# Altium project MAIN.PrjPcb (part 1 of 2)
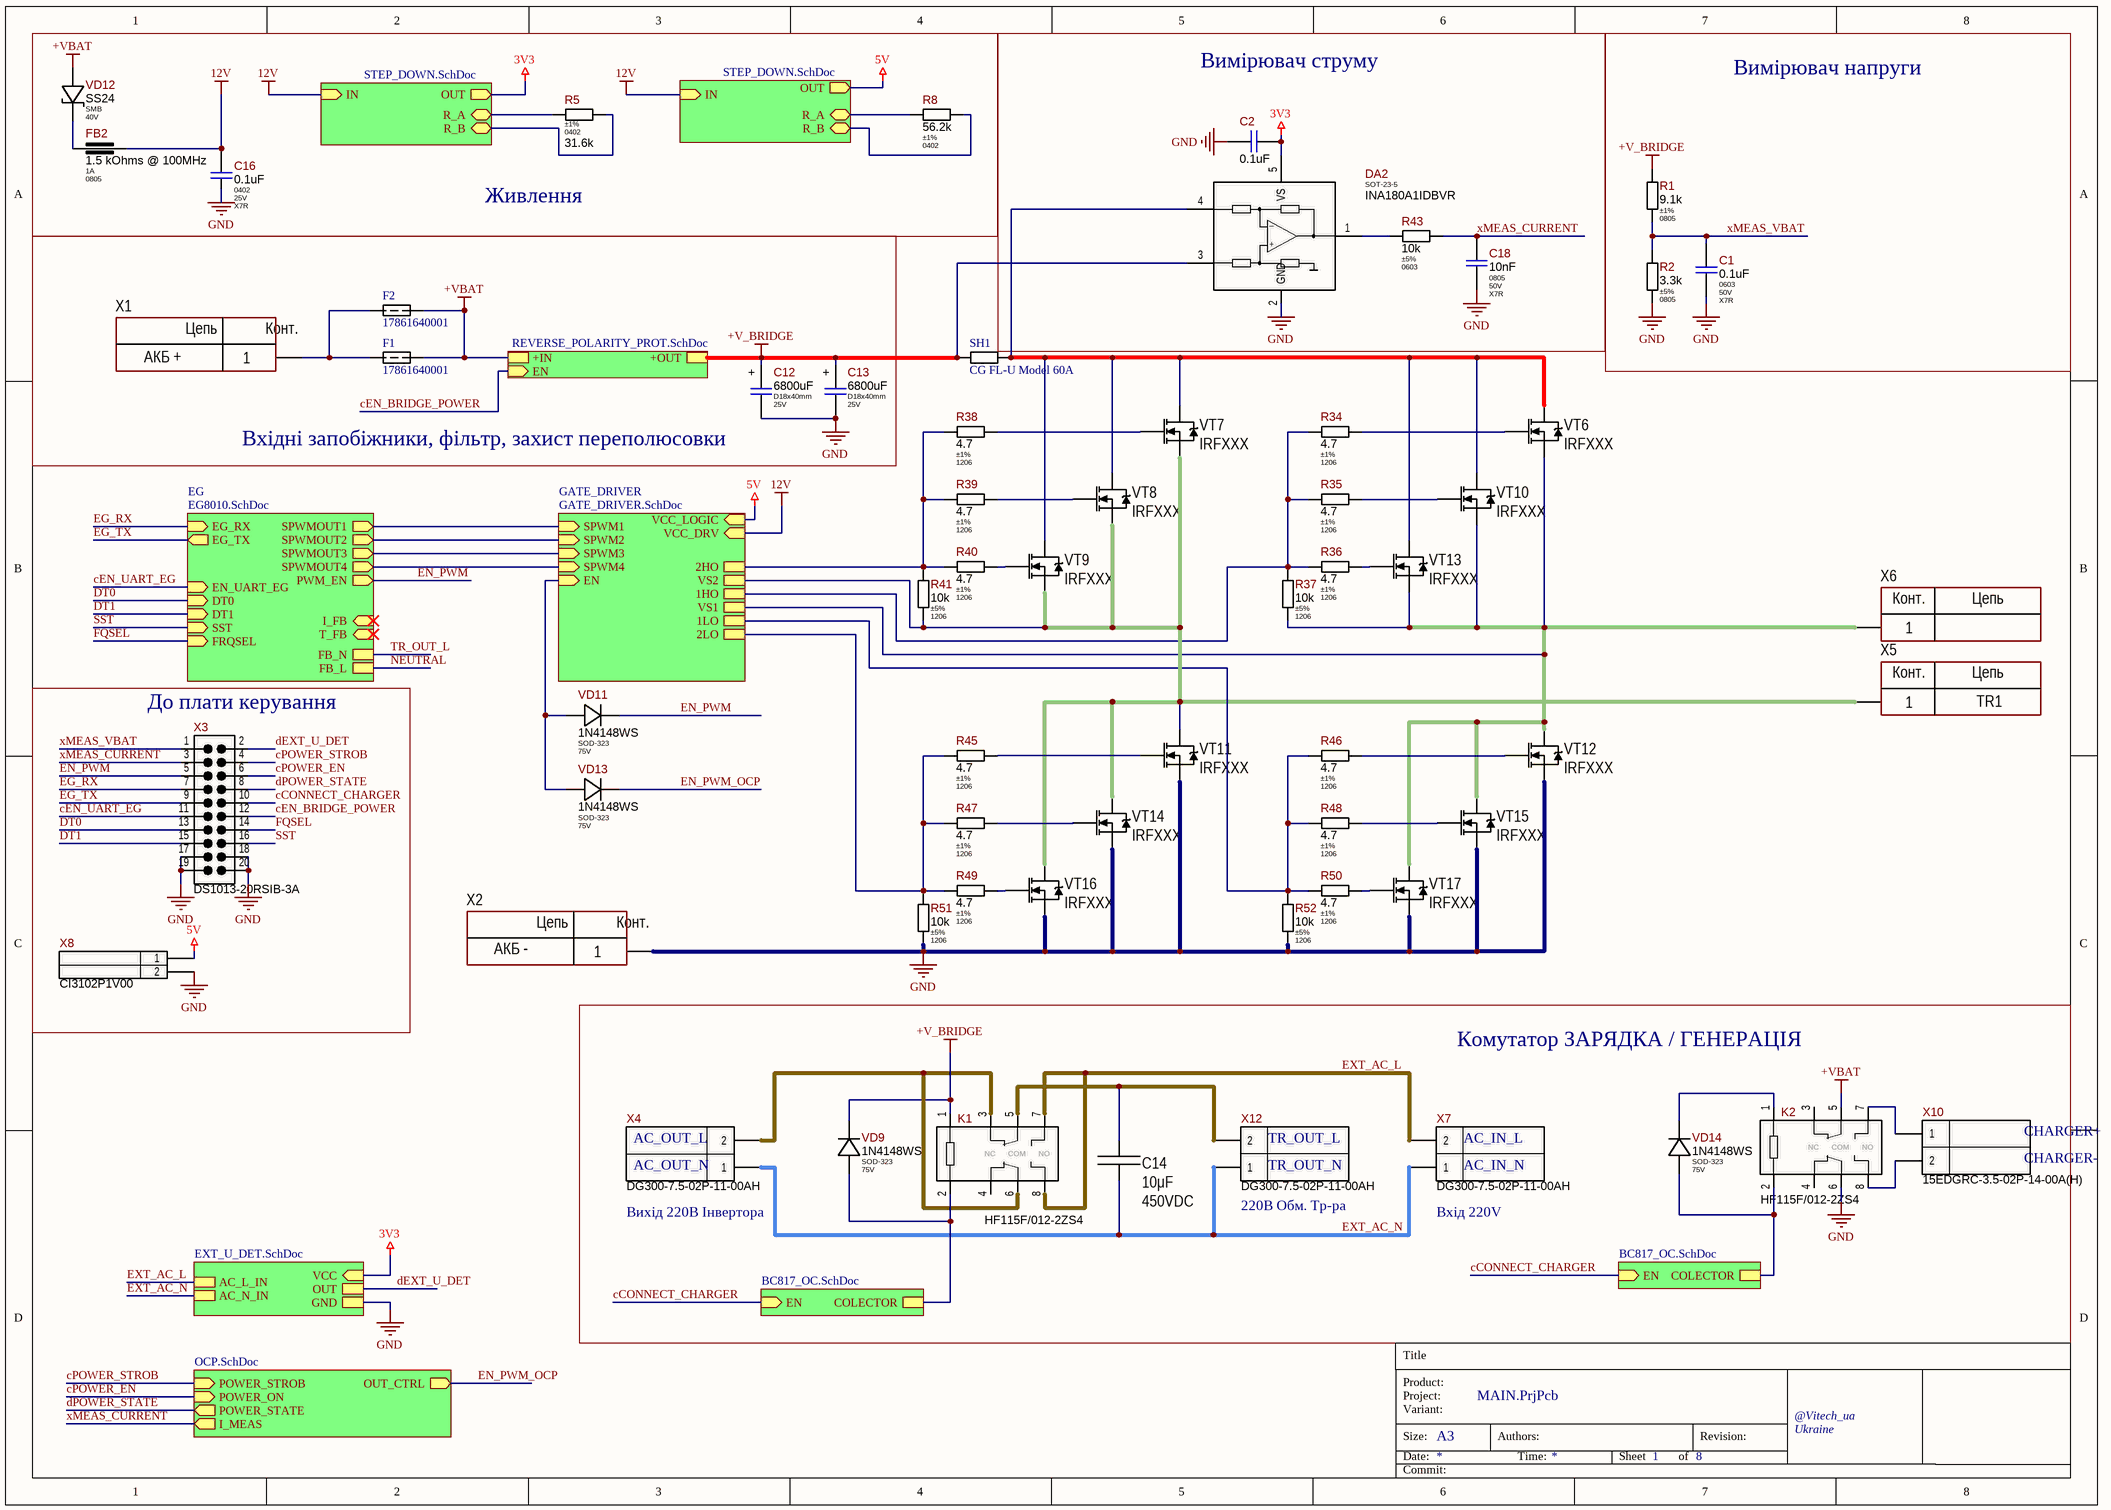
[diagram p0: main.SchDoc]
__Project_Template_Version: 1.0.2; _Amount_Boards_Per_Stand: 1; _PCB_Order_Accuracy: 0.2mm / 8mil; _PCB_Order_BoardOutlineLayer: Mechanical1 (GM1); _PCB_Order_Cooper: 1oz / 35um; _PCB_Order_ElectricTest: Necessarily for 100% samples; _PCB_Order_Finish: HASL; _PCB_Order_LayersCnt: 2; _PCB_Order_Mask: on both sides; _PCB_Order_MaskColor: Green / Yellow; _PCB_Order_Material: FR-4; _PCB_Order_MinHole: 0.3 mm; _PCB_Order_ProductionTime: 2 weeks; _PCB_Order_Silk: No; _PCB_Order_SilkColor: No; _PCB_Order_Size: 0 x 0 mm; _PCB_Order_Thickness: 1.6 mm; Authors: Starovit; Product_Name: INVERTOR; Project_ID: 001; Project_Version: 1
7 sheets, 187 parts. Net scope: hierarchical (ports join the sheet entries above them; power ports are global).
Board file: main.PcbDoc
Sheets:
  main.SchDoc
    STEP_DOWN = STEP_DOWN.SchDoc
    STEP_DOWN = STEP_DOWN.SchDoc
    EG = EG8010.SchDoc
    GATE_DRIVER = GATE_DRIVER.SchDoc
    REVERSE_POL_PROT = REVERSE_POLARITY_PROT.SchDoc
    U_DET = EXT_U_DET.SchDoc
    OCP = OCP.SchDoc

## Sheet main.SchDoc: =DocumentName
size A3; Scale: 1:1; DocumentType: Схема электрическая принципиальная; FirstReferrence: АБВГ.123456.001; Author: Starovit; CompanyName: "AS Manufacturing" LLC; Organization: "AS Manufacturing" LLC; Address1: 5 Sklyarenka St.; Address2: Kyiv 04073; Address3: Ukraine; Address4: https://ajax.systems/en/; Revision: v1; SheetNumber: 1; SheetTotal: 8; Product name: INVERTOR; Internal reference: 001; Head: INVERTOR.001.v1; PCB_Designator: INVERTOR.001.v1; Template_version: 1.0.1

### Parts
C1  Package: 0603  Voltage: 50V  Dielectric Type: X7R  [C_CERAMIC_0603_MED]  (hidden comment: 0.1uF)
C2  0.1uF  [C_CERAMIC_0402_MED]
C12  value 6800uF  Package: D18x40mm  Voltage: 25V  [CAP-AE-PTH-180D05x400H20]  (hidden comment: 6800uFx25V)
C13  value 6800uF  Package: D18x40mm  Voltage: 25V  [CAP-AE-PTH-180D05x400H20]  (hidden comment: 6800uFx25V)
C14  value 10μF  Voltage: 450VDC  [CAP: B32922 (18x7x12.5mm)]
C16  Package: 0402  Voltage: 25V  Dielectric Type: X7R  [C_CERAMIC_0402_MED]  (hidden comment: 0.1uF)
C18  Package: 0805  Voltage: 50V  Dielectric Type: X7R  [CAP-0805(2012)X65T10]  (hidden comment: 10nF)
DA2  INA180A1IDBVR  [SOT-23-5]
F1  17861640001  [17861640001]
F2  17861640001  [17861640001]
FB2  value 1.5 kOhms @ 100MHz  Current: 1A  Package: 0805  [WE-CBF-0805-Series]  (hidden comment: 742792097)
K1  HF115F/012-2ZS4  [HF115Fxxx-1(2)Zx3(4)]
K2  HF115F/012-2ZS4  [HF115Fxxx-1(2)Zx3(4)]
R1  Tolerance: ±1%  Package: 0805  [R_ANY_CHIP_0805_MED]  (hidden comment: 9.1k)
R2  Tolerance: ±5%  Package: 0805  [R_ANY_CHIP_0805_MED]  (hidden comment: 3.3k)
R5  Tolerance: ±1%  Package: 0402  [R_ANY_CHIP_0402_MED]  (hidden comment: 31.6k)
R8  Tolerance: ±1%  Package: 0402  [R_ANY_CHIP_0402_MED]  (hidden comment: 56.2k)
R34  Tolerance: ±1%  Package: 1206  [R_ANY_CHIP_1206_MED]  (hidden comment: 4.7)
R35  Tolerance: ±1%  Package: 1206  [R_ANY_CHIP_1206_MED]  (hidden comment: 4.7)
R36  Tolerance: ±1%  Package: 1206  [R_ANY_CHIP_1206_MED]  (hidden comment: 4.7)
R37  Tolerance: ±5%  Package: 1206  [R_ANY_CHIP_1206_MED]  (hidden comment: 10k)
R38  Tolerance: ±1%  Package: 1206  [R_ANY_CHIP_1206_MED]  (hidden comment: 4.7)
R39  Tolerance: ±1%  Package: 1206  [R_ANY_CHIP_1206_MED]  (hidden comment: 4.7)
R40  Tolerance: ±1%  Package: 1206  [R_ANY_CHIP_1206_MED]  (hidden comment: 4.7)
R41  Tolerance: ±5%  Package: 1206  [R_ANY_CHIP_1206_MED]  (hidden comment: 10k)
R43  Tolerance: ±5%  Package: 0603  [R_ANY_CHIP_0603_MED]  (hidden comment: 10k)
R45  Tolerance: ±1%  Package: 1206  [R_ANY_CHIP_1206_MED]  (hidden comment: 4.7)
R46  Tolerance: ±1%  Package: 1206  [R_ANY_CHIP_1206_MED]  (hidden comment: 4.7)
R47  Tolerance: ±1%  Package: 1206  [R_ANY_CHIP_1206_MED]  (hidden comment: 4.7)
R48  Tolerance: ±1%  Package: 1206  [R_ANY_CHIP_1206_MED]  (hidden comment: 4.7)
R49  Tolerance: ±1%  Package: 1206  [R_ANY_CHIP_1206_MED]  (hidden comment: 4.7)
R50  Tolerance: ±1%  Package: 1206  [R_ANY_CHIP_1206_MED]  (hidden comment: 4.7)
R51  Tolerance: ±5%  Package: 1206  [R_ANY_CHIP_1206_MED]  (hidden comment: 10k)
R52  Tolerance: ±5%  Package: 1206  [R_ANY_CHIP_1206_MED]  (hidden comment: 10k)
SH1  CG FL-U Model 60A  [CG FL-U Model 60A]
VD9  Package: SOD-323  Voltage: 75V  [SOD-323_MED]  (hidden comment: 1N4148WS)
VD11  Package: SOD-323  Voltage: 75V  [SOD-323_MED]  (hidden comment: 1N4148WS)
VD12  Package: SMB  Voltage: 40V  [SMB_MED]  (hidden comment: SS24)
VD13  Package: SOD-323  Voltage: 75V  [SOD-323_MED]  (hidden comment: 1N4148WS)
VD14  Package: SOD-323  Voltage: 75V  [SOD-323_MED]  (hidden comment: 1N4148WS)
VT6  PartNumber: IRFXXX  [TO220(H)]
VT7  PartNumber: IRFXXX  [TO220(H)]
VT8  PartNumber: IRFXXX  [TO220(H)]
VT9  PartNumber: IRFXXX  [TO220(H)]
VT10  PartNumber: IRFXXX  [TO220(H)]
VT11  PartNumber: IRFXXX  [TO220(H)]
VT12  PartNumber: IRFXXX  [TO220(H)]
VT13  PartNumber: IRFXXX  [TO220(H)]
VT14  PartNumber: IRFXXX  [TO220(H)]
VT15  PartNumber: IRFXXX  [TO220(H)]
VT16  PartNumber: IRFXXX  [TO220(H)]
VT17  PartNumber: IRFXXX  [TO220(H)]
X1  CommentText: АКБ +  [CON: 8191]
X2  CommentText: АКБ -  [CON: 8191]
X3  DS1013-20RSIB-3A  [BH-20R]
X4  DG300-7.5-02P  [DG300-7.5-02P-11-00AH_REC]  (value not drawn)
X5  CommentText: TR1  [CON: 8191]
X6  (no value)  [CON: 8191]
X7  DG300-7.5-02P  [DG300-7.5-02P-11-00AH_REC]  (value not drawn)
X8  WH-02S  [WF-2S]  (value not drawn)
X10  15EDGRC-3.5-02P-14-00A(H)  [15EDGRC-3.5-2P-14-00]
X12  DG300-7.5-02P  [DG300-7.5-02P-11-00AH_REC]  (value not drawn)

### Blocks framed on the sheet
Живлення: C16 FB2 R5 R8 VD12
Вимірювач струму: C2 C18 DA2 R43
Вимірювач напруги: C1 R1 R2
Вхідні запобіжники, фільтр, захист переполюсовки: C12 C13 F1 F2 X1
До плати керування: X3 X8
Комутатор ЗАРЯДКА / ГЕНЕРАЦІЯ: C14 K1 K2 VD9 VD14 X4 X7 X10 X12

### Sub-sheets
EG = EG8010.SchDoc: T_FB (in), I_FB (in), PWM_EN (out), SPWMOUT1 (out), SPWMOUT2 (out), SPWMOUT3 (out), SPWMOUT4 (out), EG_RX (in), EG_TX (out), DT0 (in), DT1 (in), SST (in), FRQSEL (in), FB_N, FB_L, EN_UART_EG (in)
GATE_DRIVER = GATE_DRIVER.SchDoc: SPWM3 (in), SPWM4 (in), SPWM1 (in), SPWM2 (in), EN (in), VCC_DRV (in), 2HO, 2LO, 1HO, 1LO, VS2, VS1, VCC_LOGIC (in)
OC = BC817_OC.SchDoc (file not in this document): EN (in), COLECTOR
OC = BC817_OC.SchDoc (file not in this document): EN (in), COLECTOR
OCP = OCP.SchDoc: POWER_STROB (in), POWER_ON (in), POWER_STATE (out), OUT_CTRL (out), I_MEAS (out)
REVERSE_POL_PROT = REVERSE_POLARITY_PROT.SchDoc: +IN, +OUT, EN (in)
STEP_DOWN = STEP_DOWN.SchDoc: IN (in), OUT (out), R_A (bidir), R_B (bidir)
STEP_DOWN = STEP_DOWN.SchDoc: IN (in), OUT (out), R_A (bidir), R_B (bidir)
U_DET = EXT_U_DET.SchDoc: AC_L_IN, AC_N_IN, VCC (in), OUT, GND

### Nets
3V3: C2.1 DA2.5(VS) R5.2 ; sheet STEP_DOWN/OUT, sheet STEP_DOWN/R_B, sheet U_DET/VCC
5V: R8.2 X8.1 ; sheet STEP_DOWN/OUT, sheet STEP_DOWN/R_B, sheet GATE_DRIVER/VCC_LOGIC
12V: C16.2 FB2.1 ; sheet STEP_DOWN/IN, sheet STEP_DOWN/IN, sheet GATE_DRIVER/VCC_DRV
+V_BRIDGE: C12.1 C13.1 DA2.3(IN+) K1.1(COIL1) R1.1 SH1.1 VD9.CA ; sheet REVERSE_POL_PROT/+OUT
+VBAT: F1.1 F2.1 K2.5(1-COM) VD12.AN ; sheet REVERSE_POL_PROT/+IN
GND: C1.2 C2.2 C12.2 C13.2 C16.1 C18.2 DA2.2(GND) K2.6(2-COM) R2.2 R51.1 R52.1 VT11.3(S) VT12.3(S) VT14.3(S) VT15.3(S) VT16.3(S) VT17.3(S) X2.1 X3.17 X3.18 X3.19 X3.20 X8.2 ; sheet U_DET/GND
cCONNECT_CHARGER: X3.10 ; sheet OC/EN, sheet OC/EN
cEN_BRIDGE_POWER: X3.12 ; sheet REVERSE_POL_PROT/EN
cEN_UART_EG: X3.11 ; sheet EG/EN_UART_EG
cPOWER_EN: X3.6 ; sheet OCP/POWER_ON
cPOWER_STROB: X3.4 ; sheet OCP/POWER_STROB
dEXT_U_DET: X3.2 ; sheet U_DET/OUT
dPOWER_STATE: X3.8 ; sheet OCP/POWER_STATE
DT0: X3.13 ; sheet EG/DT0
DT1: X3.15 ; sheet EG/DT1
EG_RX: X3.7 ; sheet EG/EG_RX
EG_TX: X3.9 ; sheet EG/EG_TX
EN_PWM: VD11.CA X3.5 ; sheet EG/PWM_EN
EN_PWM_OCP: VD13.CA ; sheet OCP/OUT_CTRL
EXT_AC_L: K1.7(2-NO) K1.8(2-NO) X7.2 ; sheet U_DET/AC_L_IN
EXT_AC_N: X4.1 X7.1 X12.1 ; sheet U_DET/AC_N_IN
FQSEL: X3.14 ; sheet EG/FRQSEL
SST: X3.16 ; sheet EG/SST
xMEAS_CURRENT: C18.1 R43.2 X3.3 ; sheet OCP/I_MEAS
xMEAS_VBAT: C1.1 R1.2 R2.1 X3.1
NetC14_1: C14.1 K1.5(1-COM) X12.2
NetC22_2: R41.1 VT7.3(S) VT8.3(S) VT9.3(S) VT11.2(D) VT14.2(D) VT16.2(D) X5.1 ; sheet GATE_DRIVER/VS2
NetC25_2: R37.1 VT6.3(S) VT10.3(S) VT12.2(D) VT13.3(S) VT15.2(D) VT17.2(D) X6.1 ; sheet GATE_DRIVER/VS1
NetD1A_4: R5.1 ; sheet STEP_DOWN/R_A
NetD1B_4: R8.1 ; sheet STEP_DOWN/R_A
NetDA2_1: DA2.1(OUT) R43.1
NetDA2_4: DA2.4(IN-) SH1.2 VT6.2(D) VT7.2(D) VT8.2(D) VT9.2(D) VT10.2(D) VT13.2(D)
NetDD3_4: sheet EG/SPWMOUT3, sheet GATE_DRIVER/SPWM3
NetDD3_7: sheet EG/SPWMOUT4, sheet GATE_DRIVER/SPWM4
NetDD3_9: sheet EG/SPWMOUT1, sheet GATE_DRIVER/SPWM1
NetDD3_12: sheet EG/SPWMOUT2, sheet GATE_DRIVER/SPWM2
NetF1_2: F1.2 F2.2 X1.1
NetFB2_2: FB2.2 VD12.CA
NetIC2_6: R38.1 R39.1 R40.1 R41.2 ; sheet GATE_DRIVER/2HO
NetIC3_6: R45.1 R47.1 R49.1 R51.2 ; sheet GATE_DRIVER/2LO
NetIC4_6: R34.1 R35.1 R36.1 R37.2 ; sheet GATE_DRIVER/1HO
NetIC5_6: R46.1 R48.1 R50.1 R52.2 ; sheet GATE_DRIVER/1LO
NetK1_2: K1.2(COIL2) VD9.AN ; sheet OC/COLECTOR
NetK1_3: K1.3(1-NC) K1.6(2-COM) X4.2
NetK2_1: K2.1(COIL1) VD14.CA
NetK2_2: K2.2(COIL2) VD14.AN ; sheet OC/COLECTOR
NetK2_7: K2.7(2-NO) X10.1
NetK2_8: K2.8(2-NO) X10.2
NetR34_2: R34.2 VT6.1(G)
NetR35_2: R35.2 VT10.1(G)
NetR36_2: R36.2 VT13.1(G)
NetR38_2: R38.2 VT7.1(G)
NetR39_2: R39.2 VT8.1(G)
NetR40_2: R40.2 VT9.1(G)
NetR45_2: R45.2 VT11.1(G)
NetR46_2: R46.2 VT12.1(G)
NetR47_2: R47.2 VT14.1(G)
NetR48_2: R48.2 VT15.1(G)
NetR49_2: R49.2 VT16.1(G)
NetR50_2: R50.2 VT17.1(G)
NetR60_1: VD11.AN VD13.AN ; sheet GATE_DRIVER/EN

Not connected (* = marked no-connect by the designer): C14 2; K1 4(2-NC); K2 3(1-NC) 4(2-NC)

### Notes on the sheet
- (near X4) AC_OUT_L
- (near X4) AC_OUT_N
- (near X12) TR_OUT_L
- (near X12) TR_OUT_N
- (near X7) AC_IN_L
- (near X7) AC_IN_N
- (near X10) CHARGER-
- (near X10) CHARGER+
- (near X4) Вихід 220В Інвертора
- (near X12) 220В Обм. Тр-ра
- (near X7) Вхід 220V
- Title
- Product:
- Project:
- Size:
- Date:
- Variant:
- A3
- Authors:
- Time:
- Sheet
- of
- Revision:
- @Vitech_ua
- Commit:
- (in symbol B41858C5688M000) +
- (in symbol Connector_single_power) Цепь; Конт.
- (in symbol HF115F/012-2ZS4) NC; COM; NO
- (in symbol INA180A1IDBVR) _; +

### Library data of the parts
C1 = CL10B104KB8NNND: 100nF 50V X7R ±10% 0603 Ceramic Capacitor RoHS; Manufacturer: Samsung Electro-Mechanics; Ajax_1C_ID: 21313; Ajax_1C_PN: 100nF 50V X7R 10% 0603 CL10B104KB8NNND ceramic capacitor SMD; Ajax_1С_Status: Substitution; Standard Lead Time: 18 Weeks; Component Status: Released; Replacement: CL10B104KB8NNNC; GUID_1C: f1fd6399-ca68-11ea-ab63-0050569f2651; Value: 0.1uF; Part Number: CL10B104KB8NNND; Part Type: Ceramic / X7R / 0603; Component Type: SMD; Temperature Range: -55°C ~ 125°C; Tolerance: ±10%; ComponentLink1URL: https://media.digikey.com/pdf/Data%20Sheets/Samsung%20PDFs/CL_Series_MLCC_ds.pdf; Supplier 1: Digi-Key; Supplier Part Number 1: CL10B104KB8NNND-ND; Price: 0,0039378; ComponentLink1Description: Datasheet
C2 C16 = GRM155R71E104KE14J: 100nF 25V X7R ±10% 0402 Ceramic Capacitor RoHS; Manufacturer: Murata Electronics; Ajax_1C_ID: 24481; Ajax_1C_PN: 100nF 25V X7R 10% 0402 GRM155R71E104KE14J Ceramic Capacitor SMD RoHS; Ajax_1С_Status: Mass Production; Standard Lead Time: 24 Weeks; Component Status: Released; Replacement: NONE; Value: 0.1uF; Part Number: GRM155R71E104KE14J; Part Type: Ceramic / X7R / 0402; Component Type: SMD; Temperature Range: -55°C ~ 125°C; Tolerance: ±10%; ComponentLink1URL: https://eu.mouser.com/datasheet/2/281/1/GRM155R71E104KE14_01A-1984358.pdf; ComponentLink1Description: Datasheet
  C2: Package: 0402; Voltage: 25V; Dielectric Type: X7R
C12 C13 = B41858C5688M000: 6800uF 25V ±20% Aluminum Electrolytic Capacitors Radial, 5000 Hrs @ 105°C, 4467mA Ripple Current; Manufacturer: Epcos / TDK; Ajax_1C_PN: NONE; Ajax_1С_Status: RND Only; Standard Lead Time: 36 Weeks; Component Status: Released; Part Number: B41858C5688M000; Part Type: Aluminum; Component Type: PTH; Temperature Range: -55°C ~ 105°C; Tolerance: ±20%; Dielectric Type: NONE; ComponentLink1URL: https://product.tdk.com/system/files/dam/doc/product/capacitor/aluminum-electrolytic/single-ended/data_sheet/20/30/db/aec/b41858.pdf; Supplier 1: Mouser; Supplier Part Number 1: 871-B41858C5688M; Replacement: NONE; Price: NONE; ComponentLink1Description: Datasheet
C14 = Film: Manufacturer: Epcos; PartNumber: B32774D4106K000; ValueManufacturerPartNumber: Film capacitor, 10μF, 450VDC, ±10%, 10.9mOhm, 31.5x15 mm, -40...+105°C; TypeCapacitor: Film capacitor; Tolerance: ±10%; Impedance: 10.9mOhm; Package: 31.5x15 mm; HelpURL: https://www.digikey.com/products/en/capacitors/film-capacitors/62?k=&pkeyword=&sv=0&pv2097=1958&sf=0&FV=fffc01ef%2C1f140000%2Cffe0003e%2Cffec6366&quantity=1&ColumnSort=1000011&page=1&stock=1&pageSize=25; Temperature: -40...+105°C
C18 = CL21B103KBANNNC: 10nF 50V X7R ±10% 0805 Ceramic Capacitor RoHS; Manufacturer: Samsung Electro-Mechanics; Ajax_1C_PN: NONE; Ajax_1С_Status: RND Only; Standard Lead Time: 26 Weeks; Component Status: Released; Value: 10nF; Part Number: CL21B103KBANNNC; Part Type: Ceramic / X7R / 0805; Component Type: SMD; Temperature Range: -55°C ~ 125°C; Tolerance: ±10%; ComponentLink1URL: https://eu.mouser.com/datasheet/2/585/MLCC-1837944.pdf; Supplier 1: Mouser; Supplier Part Number 1: 187-CL21B103KBANNNC; Replacement: NONE; Price: NONE; ComponentLink1Description: Datasheet
DA2 = INA180A1IDBVR: Low- and High-Side Voltage Output, 2.7V to 5.5V, Current-Sense Amplifiers, Gain 20 V/V, SOT-23-5; Manufacturer: Texas Instruments; Ajax_1C_ID: 25363; Ajax_1C_PN: INA180A1IDBVT TI Current Sense Amplifier, SOT-23-5; Ajax_1С_Status: RND Only; Standard Lead Time: 12 Weeks; Component Status: Released; Replacement: NONE; GUID_1C: 575c0dc1-4f39-11eb-ab6e-0050569f2651; Package: SOT-23-5; Part Number: INA180A1IDBVR; Part Type: Amplifier / Current Sense; Component Type: SMD; Temperature Range: -40°C ~ 125°C; ComponentLink1URL: https://www.ti.com/lit/ds/symlink/ina180.pdf; Supplier 1: Digi-Key; Supplier Part Number 1: 296-47652-2-ND; Price: 0,367; ComponentLink1Description: Datasheet
F1 F2 = 17861640001: Fuse; Manufacturer_Name: LITTELFUSE; Datasheet Link: https://www.littelfuse.com/media?resourcetype=2d-prints&itemid=dcb90cf3-0771-4ccd-8726-26101cf00574&filename=ol-178.6164.0000(c); Height: 17.5mm; Manufacturer_Part_Number: 17861640001
FB2 = 742792097: 1.5 kOhms @ 100MHz Power Line Ferrite Bead 0805, 1A 300mOhm; Manufacturer: Wurth Elektronik; Ajax_1C_ID: 84781; Ajax_1C_PN: 1.5k 1A 0805 742792097 Chip Ferrite Bead; Ajax_1С_Status: RND Only; Saturation Current: NONE; Tolerance: ±25%; Component Status: On Review; Standard Lead Time: 12 Weeks; GUID_1C: 3c69ea00-725e-11ee-a921-00505699469b; Part Number: 742792097; Part Type: Ferrite Bead; Component Type: SMD; Temperature Range: -55°C ~ 125°C; ComponentLink1URL: https://www.we-online.com/components/products/datasheet/742792097.pdf; Supplier 1: Digi-Key; Supplier Part Number 1: 732-4649-2-ND; Replacement: NONE; Price: 0,178; ComponentLink1Description: Datasheet
K1 K2 = HF115F/012-2ZS4: Miniature High Power Relay, DPDT (2 Form C), 12VDC 400mW Coil, 5.0mm 2 Pole 8A AgCdO; Manufacturer: Hongfa; Ajax_1C_ID: 38428; Ajax_1C_PN: HF115F/012-2ZS4 HONGFA, Реле; Ajax_1С_Status: RND Only; Component Status: Released; Replacement: NONE; GUID_1C: 4ba44618-64be-11ec-a90c-00505699469b; Part Number: HF115F/012-2ZS4; Part Type: Relay; Component Type: PTH; Temperature Range: -40°C ~ 85°C; ComponentLink1URL: https://www.tme.eu/Document/2962d862af219292e2e76bbc4b5ef3a2/hf115f.pdf; Supplier 1: TME; Supplier Part Number 1: HF115F/012-2ZS4; Price: 2,02140634; ComponentLink1Description: Datasheet
R1 = RC0805FR-079K1L: 9.1 kOhms ±1%, 1/8W 0805 Thick Film Resistor; Manufacturer: Yageo; Ajax_1C_ID: 9033; Ajax_1C_PN: 9.1k 1% 0805 Resistors SMD RoHS; Ajax_1С_Status: RND Only; Power Rating: 0.125W; Voltage: 150V; Component Status: Released; Temperature Stability: ±100ppm/°C; Replacement: NONE; GUID_1C: 9c2a4261-9b4a-11e6-8242-d8cb8a9acc66; Value: 9.1k; Part Number: RC0805FR-079K1L; Component Type: SMD; Part Type: Thick Film; Temperature Range: -55°C ~ 155°C; ComponentLink1URL: https://eu.mouser.com/datasheet/2/447/PYu_RC_Group_51_RoHS_L_10-1664068.pdf; Supplier 1: Digi-Key; Supplier Part Number 1: 311-9.10KCRTR-ND; Price: 0,00168; ComponentLink1Description: Datasheet
R2 = RC0805JR-073K3L: 3.3 kOhms ±5%, 1/8W 0805 Thick Film Resistor; Manufacturer: Yageo; Ajax_1C_ID: 9030; Ajax_1C_PN: 3.3k 5% 0805 Resistors SMD RoHS; Ajax_1С_Status: RND Only; Power Rating: 0.125W; Voltage: 150V; Component Status: Released; Temperature Stability: ±100ppm/°C; Replacement: NONE; GUID_1C: cb9785ec-9b47-11e6-8242-d8cb8a9acc66; Value: 3.3k; Part Number: RC0805JR-073K3L; Component Type: SMD; Part Type: Thick Film; Temperature Range: -55°C ~ 155°C; ComponentLink1URL: https://eu.mouser.com/datasheet/2/447/PYu_RC_Group_51_RoHS_L_10-1664068.pdf; Price: 0,001081; ComponentLink1Description: Datasheet
R5 = RC0402FR-0731K6L: 31.6 kOhms ±1% 1/16W 0402 Thick Film Resistor; Manufacturer: Yageo; Ajax_1C_ID: 42440; Ajax_1C_PN: 31.6k 1% 0402 Resistors SMD RoHS; Ajax_1С_Status: RND Only; Power Rating: 0.062W; Voltage: 50V; Component Status: Released; Temperature Stability: ±100ppm/°C; Replacement: NONE; Value: 31.6k; Part Number: RC0402FR-0731K6L; Component Type: SMD; Temperature Range: -55°C ~ 155°C; ComponentLink1URL: https://eu.mouser.com/datasheet/2/447/PYu_RC_Group_51_RoHS_L_11-1984063.pdf; Supplier 1: Mouser; Supplier Part Number 1: 603-RC0402FR-0731K6L; ComponentLink1Description: Datasheet; Part Type: Thick Film
R8 = RC0402FR-0756K2L: 56.2 kOhms ±1% 1/16W 0402 Thick Film Resistor; Manufacturer: Yageo; Ajax_1C_ID: 20241; Ajax_1C_PN: 56.2k 1% 0402 Resistors SMD RoHS; Ajax_1С_Status: Mass Production; Power Rating: 0.062W; Voltage: 50V; Component Status: Released; Temperature Stability: ±100ppm/°C; Replacement: NONE; GUID_1C: 73881b35-8945-11ea-ab60-0050569f2651; Value: 56.2k; Part Number: RC0402FR-0756K2L; Component Type: SMD; Part Type: Thick Film; Temperature Range: -55°C ~ 155°C; ComponentLink1URL: https://eu.mouser.com/datasheet/2/447/PYu_RC_Group_51_RoHS_L_11-1984063.pdf; Supplier 1: Digi-Key; Supplier Part Number 1: YAG3187TR-ND; Price: 0,00065; ComponentLink1Description: Datasheet
R34-R36 R38-R40 R45-R50 = RC1206FR-074R7L: 4.7 Ohms ±1%, 1/4W 1206 Thick Film Resistor; Manufacturer: Yageo; Ajax_1C_ID: 32212; Ajax_1C_PN: 4.7R 1% 1206 0.25W Resistors SMD RoHS; Ajax_1С_Status: Mass Production; Power Rating: 0.25W; Voltage: 200V; Component Status: Released; Temperature Stability: ±200ppm/°C; Replacement: NONE; GUID_1C: de4b8aaa-eaef-11eb-ab74-0050569f2651; Value: 4.7; Part Number: RC1206FR-074R7L; Component Type: SMD; Part Type: Thick Film; Temperature Range: -55°C ~ 155°C; ComponentLink1URL: https://eu.mouser.com/datasheet/2/447/PYu_RC_Group_51_RoHS_L_11-1984063.pdf; Supplier 1: Digi-Key; Supplier Part Number 1: 311-4.70FRTR-ND; Price: 0,0021; ComponentLink1Description: Datasheet
R37 R41 R51 R52 = RC1206JR-0710KL: 10 kOhms ±5% 1/4W 1206 Thick Film Resistor; Manufacturer: Yageo; Ajax_1C_ID: 29423; Ajax_1C_PN: 10k 5% 1206 Resistors SMD RoHS; Ajax_1С_Status: RND Only; Power Rating: 0.25W; Voltage: 200V; Component Status: Released; Temperature Stability: ±100ppm/°C; Replacement: NONE; GUID_1C: e3e7c694-a8f0-11eb-ab74-0050569f2651; Value: 10k; Part Number: RC1206JR-0710KL; Component Type: SMD; Part Type: Thick Film; Temperature Range: -55°C ~ 155°C; ComponentLink1URL: https://eu.mouser.com/datasheet/2/447/PYu_RC_Group_51_RoHS_L_11-1984063.pdf; Supplier 1: Digi-Key; Supplier Part Number 1: 311-10KERTR-ND; Price: 0,0018; ComponentLink1Description: Datasheet
R43 = RC0603JR-0710KL: 10 kOhms ±5%, 1/10W 0603 Thick Film Resistor; Manufacturer: Yageo; Ajax_1C_ID: 2860; Ajax_1C_PN: 10k 5% 0603 Resistors SMD RoHS; Ajax_1С_Status: Mass Production; Power Rating: 0.1W; Voltage: 75V; Component Status: Released; Temperature Stability: ±100ppm/°C; Replacement: NONE; GUID_1C: df4c2852-e567-11e2-9779-6c626deda1bb; Value: 10k; Part Number: RC0603JR-0710KL; Component Type: SMD; Part Type: Thick Film; Temperature Range: -55°C ~ 155°C; ComponentLink1URL: https://eu.mouser.com/datasheet/2/447/PYu_RC_Group_51_RoHS_L_10-1664068.pdf; Supplier 1: Digi-Key; Supplier Part Number 1: 311-10KGRTR-ND; Price: 0,0006; ComponentLink1Description: Datasheet
VD9 VD11 VD13 VD14 = 1N4148WS: Diode Standard 75V 150mA, SOD-323F; Manufacturer: Diodec Semiconductor; Ajax_1C_ID: 10255; Ajax_1C_PN: 1N4148WS diotec SOD-323; Ajax_1С_Status: Mass Production; Marking: W2; Component Status: Released; Standard Lead Time: NONE; Vf: 1V @ 50mA; Replacement: 1N4148WS-E; GUID_1C: 3d8ac204-519f-11e7-8106-14dda9d2d04d; Part Type: Fast Switching; Component Type: SMD; Current: 150mA; Temperature Range: -55°C ~ 150°C; ComponentLink1URL: https://diotec.com/tl_files/diotec/files/pdf/datasheets/1n4148ws.pdf; Supplier 1: TME; Supplier Part Number 1: 1N4148WS-DIO; Price: 0,00864; ComponentLink1Description: Datasheet; Part Number: 1N4148WS
VD12 = SS24: Diode Schottky 40V 2A, SMB; Manufacturer: Vishay Semiconductor; Ajax_1C_ID: 1327; Ajax_1C_PN: SK24/SK26/SS24/SS26, диод; Ajax_1С_Status: Mass Production; Component Status: Released; Standard Lead Time: 11 Weeks; Vf: 500mV @ 2A; Replacement: NONE; GUID_1C: ee69b8b3-dd45-11e0-af93-6c626deda1bb; Part Number: SS24; Part Type: Schottky; Component Type: SMD; Marking: SS24; Current: 2A; Temperature Range: -65°C ~ 125°C; ComponentLink1URL: https://www.vishay.com/docs/88748/ss22.pdf; Supplier 1: Digi-Key; Supplier Part Number 1: SS24-E3/52TGITR-ND; Price: 0,038895; ComponentLink1Description: Datasheet
VT6-VT17 = MOSFET_N_123: Manufacturer: Infineon Technologies; ValueManufacturerPartNumber: MOSFET N-channel transistor, 80V, 7A, 9.1nC, 2.5W, 34mOhm, 756pF, 8-TDSON, -55...+150°C; TypeTransistor: MOSFET N-channel transistor; VoltageDS: 80V; CurrentDS: 7A; RDS: 34mOhm; GateCharge: 9.1nC; InputCapacitor: 756pF; MaxPower: 2.5W; Package: 8-TDSON; HelpURL: https://www.digikey.com/product-detail/en/infineon-technologies/BSC340N08NS3GATMA1/BSC340N08NS3GATMA1TR-ND/2080655; Temperature: -55...+150°C
X1 X2 X5 X6 = Connector_single_power: ValueManufacturerPartNumber: Power connector, *, *; TypeConnector: Power connector; Manufacturer: *; HelpURL: *; PartNumber: *; VoltageMax: *; CurrentMax: *
X3 = DS1013-20RSIB-3A: 2.54mm Right Angle Box Header, Two Rows, 20 Pin, 20mOhm max, Male IDC BH-20R; Manufacturer: Connfly; Ajax_1C_ID: 8560; Ajax_1C_PN: BH-20R : Вилка в плату IDC угловая : IDC-20MR; Ajax_1С_Status: Mass Production; Component Status: Released; Replacement: NONE; GUID_1C: 731205be-314d-11e6-81b9-d8cb8a9acc66; Part Number: DS1013-20RSIB-3A; Part Type: IDC (Box Header) / Right Angle; Component Type: PTH; Temperature Range: -40°C ~ 105°C; ComponentLink1URL: \\altiumdb.ajax.local\files\Datasheet\Connectors\DS1013.pdf; Price: 0,1; ComponentLink1Description: Datasheet
X4 X7 X12 = DG300-7.5-02P-11-00AH: Screw Terminal, 7.5mm Pitch, 2 pin, Grey; Manufacturer: Degson; Ajax_1C_ID: 14664; Ajax_1С_Status: RND Only; Component Status: Released; Replacement: NONE; GUID_1C: 80a5b435-17ec-11e9-ab4d-0050569f1984; Part Number: DG300-7.5-02P-11-00AH; Ajax_1C_PN: DG300-7.5-02P-11-00AH; Part Type: Terminal; Component Type: PTH; Temperature Range: -30°C ~ 120°C; ComponentLink1URL: https://www.tme.eu/Document/adcdc895102d44b158b752608cb08ff1/DG300-5.0.pdf; Supplier 1: TME; Supplier Part Number 1: DG300-7.5-2P11; Price: 0,108; ComponentLink1Description: Datasheet
X8 = CI3102P1V00: WH Series 2.54mm Wire to Board Straight DIP Type Headers, 2 Pin; Manufacturer: CviLux; Ajax_1C_ID: 6817; Ajax_1C_PN: WF-02S (DS1070-2M) Штекер "папа"; 2 контакта; шаг 2.54мм; прямой; на плату; Ajax_1С_Status: RND Only; Component Status: Released; Replacement: NONE; GUID_1C: 74812bc3-35d6-11e5-ad28-a45d36c4a9e5; Part Number: CI3102P1V00; Part Type: Wire-to-Board / Header; Component Type: PTH; Temperature Range: -25℃ ~ 85℃; ComponentLink1URL: \\altiumdb.ajax.local\files\Datasheet\Connectors\CI3102S.pdf; Price: 0,016; ComponentLink1Description: Datasheet
X10 = 15EDGRC-3.5-02P-14-00A(H): Pluggable Terminal Block, 3.5mm Pitch, 2 Pin, Right Angle, 7A/250V, Green; Manufacturer: Degson; Ajax_1C_ID: 36870; Ajax_1C_PN: 15EDGRC-3.5-02P-14-00A[H] , клеммник; Ajax_1С_Status: RND Only; Component Status: Released; Replacement: NONE; GUID_1C: aa44d4a6-4dc7-11ec-a356-005056994834; Part Number: 15EDGRC-3.5-02P-14-00A(H); Part Type: Terminal / Pluggable; Component Type: PTH; Temperature Range: -40°C ~ 105°C; ComponentLink1URL: \\altiumdb.ajax.local\files\Datasheet\Connectors\15EDGRC-3.5-XXP-1Y-00A(H).pdf; Supplier 1: TME; Supplier Part Number 1: 15EDGRC-3.5/2P; Price: 0,10172662; ComponentLink1Description: Datasheet
SH1 = CG FL-U Model 60A: link: http://www.cnchog.com/products/40a-220a-ID167.html

## Sheet STEP_DOWN.SchDoc: =DocumentName
size A4; ENG_APP_DATE: --/--/--; DSN_APP_DATE: --/--/--; CHK_APP_DATE: --/--/--; Author: Starovit; CompanyName: "AS Manufacturing" LLC; Organization: "AS Manufacturing" LLC; Address1: 5 Sklyarenka St.; Address2: Kyiv 04073; Address3: Ukraine; Address4: https://ajax.systems/en/; Revision: v1; SheetNumber: 2; SheetTotal: 4; Product name: INVERTOR; Internal reference: 001; Head: INVERTOR.001.v1; PCB_Designator: INVERTOR.001.v1; Template_version: 1.0.1
Used 2 times, as channels STEP_DOWN, STEP_DOWN. Parts and nets are listed once, with the designators drawn on the sheet.
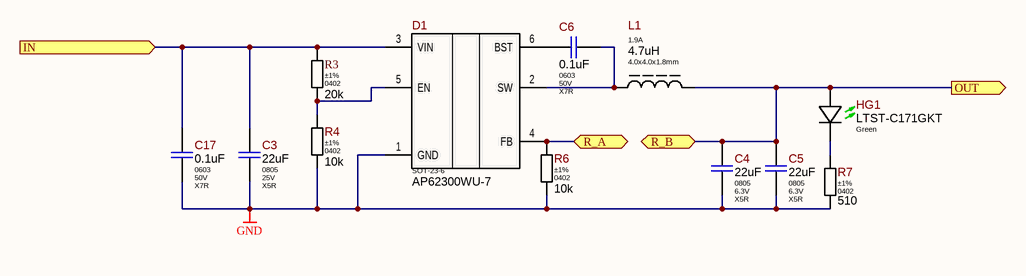
[diagram p1: STEP_DOWN.SchDoc]

### Parts
C3  Package: 0805  Voltage: 25V  Dielectric Type: X5R  [CAP-0805(2012)X125T20]  (hidden comment: 22uF)
C4  Package: 0805  Voltage: 6.3V  Dielectric Type: X5R  [C_CERAMIC_0805_MED]  (hidden comment: 22uF)
C5  Package: 0805  Voltage: 6.3V  Dielectric Type: X5R  [C_CERAMIC_0805_MED]  (hidden comment: 22uF)
C6  Package: 0603  Voltage: 50V  Dielectric Type: X7R  [C_CERAMIC_0603_MED]  (hidden comment: 0.1uF)
C17  Package: 0603  Voltage: 50V  Dielectric Type: X7R  [C_CERAMIC_0603_MED]  (hidden comment: 0.1uF)
D1  AP62300WU-7  [SOT-23-6]
HG1  Color: Green  [LTST-C171GKT]  (hidden comment: LTST-C171GKT)
L1  Current: 1.9A  Package: 4.0x4.0x1.8mm  [SRN4018-Series_1.8mm]  (hidden comment: 4.7uH)
R3  Tolerance: ±1%  Package: 0402  [R_ANY_CHIP_0402_MED]  (hidden comment: 20k)
R4  Tolerance: ±1%  Package: 0402  [R_ANY_CHIP_0402_MED]  (hidden comment: 10k)
R6  Tolerance: ±1%  Package: 0402  [R_ANY_CHIP_0402_MED]  (hidden comment: 10k)
R7  Tolerance: ±1%  Package: 0402  [R_ANY_CHIP_0402_MED]  (hidden comment: 510)

### Ports
IN (in), OUT (out), R_A (bidir), R_B (bidir)

### Nets
GND: C3.2 C4.2 C5.2 C17.1 D1.1(GND) R4.2 R6.2 R7.1
IN: C3.1 C17.2 D1.3(VIN) R3.1 ; port IN
OUT: C4.1 C5.1 HG1.AN(Anode) L1.2 ; port OUT, port R_B
R_A: D1.4(FB) R6.1 ; port R_A
NetC6_1: C6.1 D1.2(SW) L1.1
NetC6_2: C6.2 D1.6(BST)
NetD1_5: D1.5(EN) R3.2 R4.1
NetHG1_CA: HG1.CA(Cathode) R7.2

### Channels
STEP_DOWN: designators end in A; ports IN=12V OUT=3V3 R_A=NetD1A_4 R_B=3V3
STEP_DOWN: designators end in B; ports IN=12V OUT=5V R_A=NetD1B_4 R_B=5V

### Notes on the sheet
- Title
- Product:
- Project:
- Size:
- Date:
- Variant:
- A4
- Authors:
- Time:
- Sheet
- of
- Revision:
- Commit:

### Library data of the parts
C3 = CL21A226MAYNNNE: 22uF 25V X5R ±20% 0805 Ceramic Capacitor RoHS; Manufacturer: Samsung Electro-Mechanics; Ajax_1C_ID: 35089; Ajax_1C_PN: 22uF 25V X5R 20% 0805 CL21A226MAYNNNE Ceramic Capacitor SMD RoHS; Ajax_1С_Status: Mass Production; Standard Lead Time: 24 Weeks; Component Status: Released; Replacement: NONE; Value: 22uF; Part Number: CL21A226MAYNNNE; Part Type: Ceramic / X5R / 0805; Component Type: SMD; Temperature Range: -55°C ~ 85°C; Tolerance: ±20%; ComponentLink1URL: https://eu.mouser.com/datasheet/2/585/MLCC-1837944.pdf; Supplier 1: Mouser; Supplier Part Number 1: 187-CL21A226MAYNNNE; ComponentLink1Description: Datasheet
C4 C5 = GRM21BR60J226ME39L: 22uF 6.3V X5R ±20% 0805 Ceramic Capacitor RoHS; Manufacturer: Murata Electronics; Ajax_1C_ID: 10647; Ajax_1C_PN: 22uF 6.3V X5R 20% 0805 GRM21BR60J226ME39L / CL21A226MQQNNNG Ceramic Capacitor SMD RoHS; Ajax_1С_Status: Mass Production; Standard Lead Time: 15 Weeks; Component Status: Released; Replacement: NONE; Value: 22uF; Part Number: GRM21BR60J226ME39L; Part Type: Ceramic / X5R / 0805; Component Type: SMD; Temperature Range: -55°C ~ 85°C; Tolerance: ±20%; ComponentLink1URL: https://search.murata.co.jp/Ceramy/image/img/A01X/G101/ENG/GRM21BR60J226ME39-01.pdf; Supplier 1: Digi-Key; Supplier Part Number 1: 490-1719-2-ND; ComponentLink1Description: Datasheet
C6 C17 = CL10B104KB8NNND: as C1 on sheet main; Value: 0.1uF; Part Number: CL10B104KB8NNND; Part Type: Ceramic / X7R / 0603; Component Type: SMD; Temperature Range: -55°C ~ 125°C; Tolerance: ±10%; ComponentLink1URL: https://media.digikey.com/pdf/Data%20Sheets/Samsung%20PDFs/CL_Series_MLCC_ds.pdf; Supplier 1: Digi-Key; Supplier Part Number 1: CL10B104KB8NNND-ND; Price: 0,0039378; ComponentLink1Description: Datasheet
D1 = AP62300WU-7: 4.35V to 18V, 2A, High Efficiency Synchronous Step Down Converter, 500kHz, SOT-23-6; Manufacturer: Diodes Incorporated; Ajax_1С_Status: RND Only; Component Status: Released; Replacement: NONE; Part Type: Power / DC-DC / Buck; Component Type: SMD; Temperature Range: -40°C ~ 85°C; ComponentLink1Description: Datasheet; Package: SOT-23-6; Part Number: AP62300WU-7
HG1 = LTST-C171GKT: Low Power LED, Green 565nm, Clear, SMD 0805, Vf 2.1V - 2.6V, 5 ~ 12mcd @ 20 mA, 130°; Manufacturer: Lite-On Optoelectronics; Ajax_1C_PN: LTST-C171GKT Green SMD LED 0805 12mcd 20mA 130deg RoHS; Replacement: NONE; Ajax_1C_ID: 30364; Ajax_1С_Status: RND Only; Component Status: Released; GUID_1C: df39881f-c399-11eb-ab74-0050569f2651; Part Number: LTST-C171GKT; Part Type: LED / 0805; Component Type: SMD; Package: 0805; Wavelength: 565nm; Temperature Range: -55°C ~ 85°C; ComponentLink1URL: https://media.digikey.com/pdf/Data%20Sheets/Lite-On%20PDFs/LTST-C171GKT.pdf; Supplier 1: Digi-Key; Supplier Part Number 1: 160-1423-2-ND; ComponentLink1Description: Datasheet; Price: 0,0319
L1 = SRN4018-4R7M: 4.7uH Semi-Shielded Wirewound Inductor 1.9A 84mOhm Max; Manufacturer: Bourns Inc; Ajax_1C_ID: 20972; Ajax_1C_PN: 4.7uH SRN4018-4R7M SMD Индуктивность; Ajax_1С_Status: RND Only; Saturation Current: 2A; Tolerance: ±20%; Component Status: Released; Standard Lead Time: 42 Weeks; Replacement: NONE; Value: 4.7uH; Part Number: SRN4018-4R7M; Part Type: Power / Wirewound / Ferrite Core; Component Type: SMD; Temperature Range: -25°C ~ 120°C; ComponentLink1URL: https://eu.mouser.com/datasheet/2/54/srn4018-1391320.pdf; Supplier 1: Mouser; Supplier Part Number 1: 652-SRN4018-4R7M; ComponentLink1Description: Datasheet
R3 = RC0402FR-0720KL: 20 kOhms ±1% 1/16W 0402 Thick Film Resistor; Manufacturer: Yageo; Ajax_1C_ID: 7763; Ajax_1C_PN: 20k 1% 0402 Resistors SMD RoHS; Ajax_1С_Status: Mass Production; Power Rating: 0.062W; Voltage: 50V; Component Status: Released; Temperature Stability: ±100ppm/°C; Replacement: NONE; GUID_1C: 6df97e9a-d55b-11e5-8149-d8cb8a9acc66; Value: 20k; Part Number: RC0402FR-0720KL; Component Type: SMD; Part Type: Thick Film; Temperature Range: -55°C ~ 155°C; ComponentLink1URL: https://www.yageo.com/upload/media/product/productsearch/datasheet/rchip/PYu-RC_Group_51_RoHS_L_10.pdf; Price: 0,00065; ComponentLink1Description: Datasheet
R4 R6 = RC0402FR-0710KL: 10 kOhms ±1% 1/16W 0402 Thick Film Resistor; Manufacturer: Yageo; Ajax_1C_ID: 6717; Ajax_1C_PN: 10k 1% 0402 Resistors SMD RoHS; Ajax_1С_Status: Mass Production; Power Rating: 0.062W; Voltage: 50V; Component Status: Released; Temperature Stability: ±100ppm/°C; Replacement: NONE; Value: 10k; Part Number: RC0402FR-0710KL; Component Type: SMD; Temperature Range: -55°C ~ 155°C; ComponentLink1URL: https://www.yageo.com/upload/media/product/productsearch/datasheet/rchip/PYu-RC_Group_51_RoHS_L_10.pdf; ComponentLink1Description: Datasheet; Part Type: Thick Film; Supplier 1: Digi-Key; Supplier Part Number 1: 311-10.0KLRTR-ND
R7 = RC0402FR-07510RL: 510 Ohms ±1% 1/16W 0402 Thick Film Resistor; Manufacturer: Yageo; Ajax_1C_ID: 6480; Ajax_1C_PN: 510R 1% 0402 Resistors SMD RoHS; Power Rating: 0.062W; Voltage: 50V; Temperature Stability: ±100ppm/°C; Replacement: NONE; Ajax_1С_Status: Mass Production; Component Status: Released; GUID_1C: 3e23e3f0-fe1a-11e4-ad28-a45d36c4a9e5; Value: 510; Part Number: RC0402FR-07510RL; Component Type: SMD; Temperature Range: -55°C ~ 155°C; ComponentLink1URL: https://www.yageo.com/upload/media/product/productsearch/datasheet/rchip/PYu-RC_Group_51_RoHS_L_10.pdf; ComponentLink1Description: Datasheet; Supplier 1: Digi-Key; Supplier Part Number 1: 311-510LRTR-ND; Price: 0,00065; Part Type: Thick Film

## Sheet EG8010.SchDoc: =DocumentName
size A4; Author: Starovit; CompanyName: "AS Manufacturing" LLC; Organization: "AS Manufacturing" LLC; Address1: 5 Sklyarenka St.; Address2: Kyiv 04073; Address3: Ukraine; Address4: https://ajax.systems/en/; Revision: v1; SheetNumber: 1; SheetTotal: 1; Product name: INVERTOR; Internal reference: 001; Head: INVERTOR.001.v1; PCB_Designator: INVERTOR.001.v1; Template_version: 1.0.1
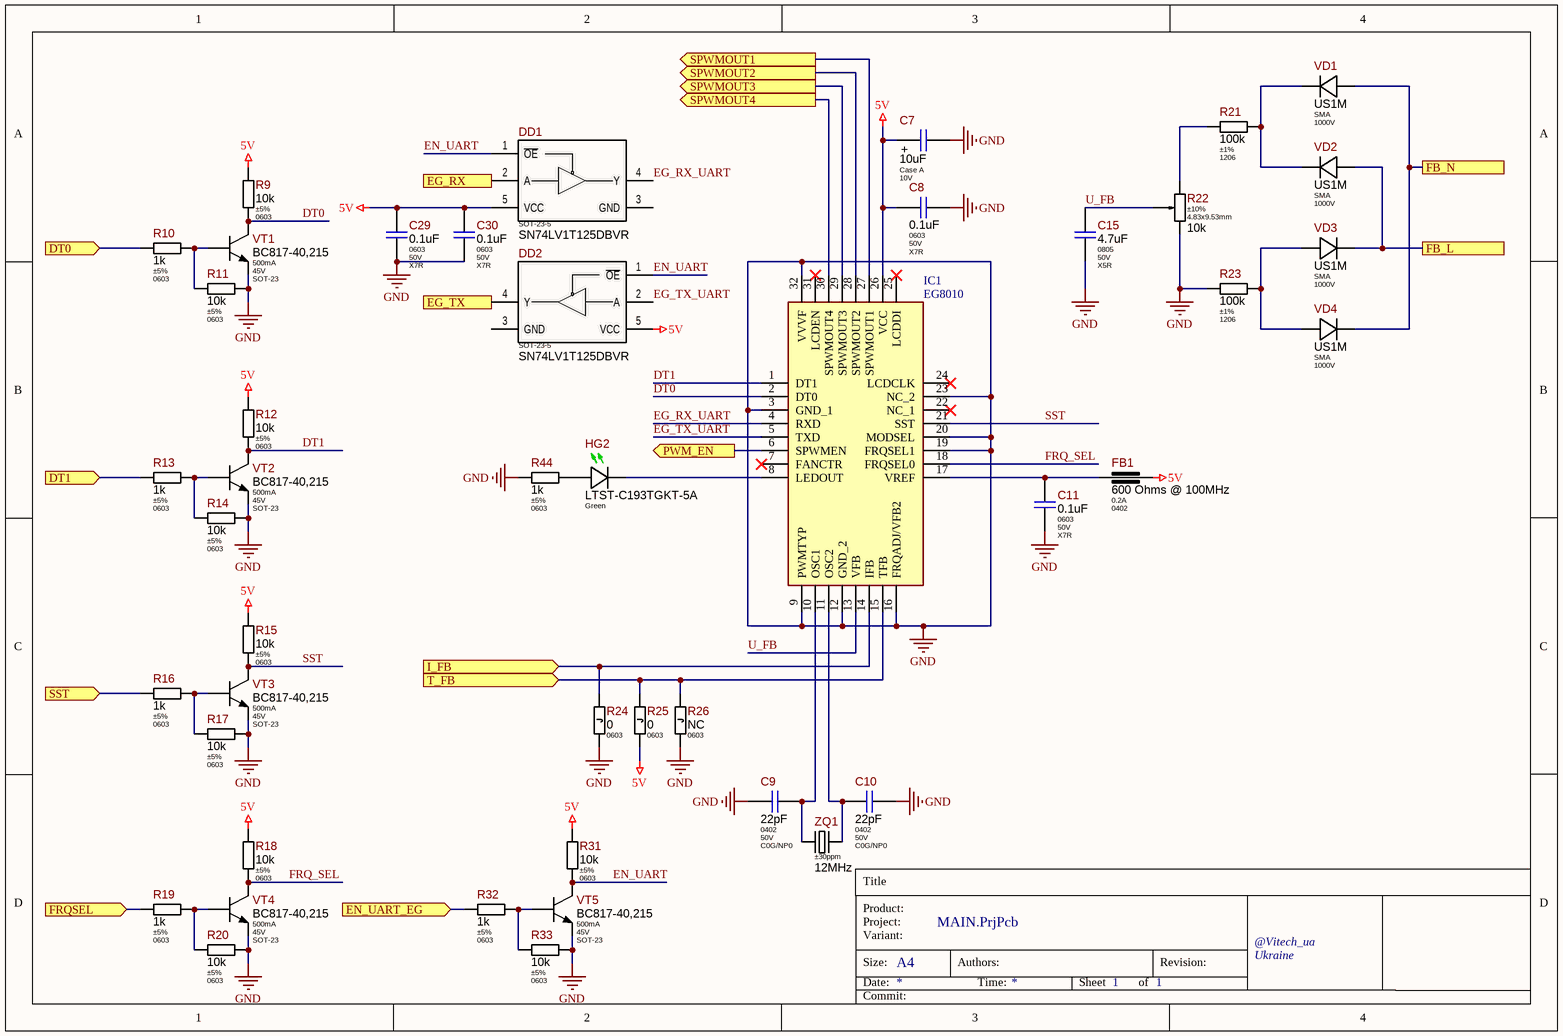
[diagram p2: EG8010.SchDoc]

### Parts
C7  Package: Case A  Voltage: 10V  [C_TANTAL_CASE_A_MED]  (hidden comment: 10uF)
C8  Package: 0603  Voltage: 50V  Dielectric Type: X7R  [C_CERAMIC_0603_MED]  (hidden comment: 0.1uF)
C9  Package: 0402  Voltage: 50V  Dielectric Type: C0G/NP0  [C_CERAMIC_0402_MED]  (hidden comment: 22pF)
C10  Package: 0402  Voltage: 50V  Dielectric Type: C0G/NP0  [C_CERAMIC_0402_MED]  (hidden comment: 22pF)
C11  Package: 0603  Voltage: 50V  Dielectric Type: X7R  [C_CERAMIC_0603_MED]  (hidden comment: 0.1uF)
C15  Package: 0805  Voltage: 50V  Dielectric Type: X5R  [C_CERAMIC_0805_MED]  (hidden comment: 4.7uF)
C29  Package: 0603  Voltage: 50V  Dielectric Type: X7R  [C_CERAMIC_0603_MED]  (hidden comment: 0.1uF)
C30  Package: 0603  Voltage: 50V  Dielectric Type: X7R  [C_CERAMIC_0603_MED]  (hidden comment: 0.1uF)
DD1  SN74LV1T125DBVR  [SOT-23-5]
DD2  SN74LV1T125DBVR  [SOT-23-5]
FB1  value 600 Ohms @ 100MHz  Current: 0.2A  Package: 0402  [BLM15xxxxxSN1x_MED]  (hidden comment: BLM15BD601SN1D)
HG2  Color: Green  [LTST-C193xGKT-5A]  (hidden comment: LTST-C193TGKT-5A)
IC1  EG8010  [QFP80P900X900X160-32N]
R9  Tolerance: ±5%  Package: 0603  [R_ANY_CHIP_0603_MED]  (hidden comment: 10k)
R10  Tolerance: ±5%  Package: 0603  [R_ANY_CHIP_0603_MED]  (hidden comment: 1k)
R11  Tolerance: ±5%  Package: 0603  [R_ANY_CHIP_0603_MED]  (hidden comment: 10k)
R12  Tolerance: ±5%  Package: 0603  [R_ANY_CHIP_0603_MED]  (hidden comment: 10k)
R13  Tolerance: ±5%  Package: 0603  [R_ANY_CHIP_0603_MED]  (hidden comment: 1k)
R14  Tolerance: ±5%  Package: 0603  [R_ANY_CHIP_0603_MED]  (hidden comment: 10k)
R15  Tolerance: ±5%  Package: 0603  [R_ANY_CHIP_0603_MED]  (hidden comment: 10k)
R16  Tolerance: ±5%  Package: 0603  [R_ANY_CHIP_0603_MED]  (hidden comment: 1k)
R17  Tolerance: ±5%  Package: 0603  [R_ANY_CHIP_0603_MED]  (hidden comment: 10k)
R18  Tolerance: ±5%  Package: 0603  [R_ANY_CHIP_0603_MED]  (hidden comment: 10k)
R19  Tolerance: ±5%  Package: 0603  [R_ANY_CHIP_0603_MED]  (hidden comment: 1k)
R20  Tolerance: ±5%  Package: 0603  [R_ANY_CHIP_0603_MED]  (hidden comment: 10k)
R21  Tolerance: ±1%  Package: 1206  [R_ANY_CHIP_1206_MED]  (hidden comment: 100k)
R22  Tolerance: ±10%  Package: 4.83x9.53mm  [3296W-1-xxx]  (hidden comment: 10k)
R23  Tolerance: ±1%  Package: 1206  [R_ANY_CHIP_1206_MED]  (hidden comment: 100k)
R24  Package: 0603  [R_ANY_CHIP_0603_MED]  (hidden comment: 0)
R25  Package: 0603  [R_ANY_CHIP_0603_MED]  (hidden comment: 0)
R26  Package: 0603  [R_ANY_CHIP_0603_MED]  (hidden comment: NC)
R31  Tolerance: ±5%  Package: 0603  [R_ANY_CHIP_0603_MED]  (hidden comment: 10k)
R32  Tolerance: ±5%  Package: 0603  [R_ANY_CHIP_0603_MED]  (hidden comment: 1k)
R33  Tolerance: ±5%  Package: 0603  [R_ANY_CHIP_0603_MED]  (hidden comment: 10k)
R44  Tolerance: ±5%  Package: 0603  [R_ANY_CHIP_0603_MED]  (hidden comment: 1k)
VD1  Package: SMA  Voltage: 1000V  [SMA_MED]  (hidden comment: US1M)
VD2  Package: SMA  Voltage: 1000V  [SMA_MED]  (hidden comment: US1M)
VD3  Package: SMA  Voltage: 1000V  [SMA_MED]  (hidden comment: US1M)
VD4  Package: SMA  Voltage: 1000V  [SMA_MED]  (hidden comment: US1M)
VT1  Ic: 500mA  Vce: 45V  Package: SOT-23  [SOT-23_MED]  (hidden comment: BC817-40,215)
VT2  Ic: 500mA  Vce: 45V  Package: SOT-23  [SOT-23_MED]  (hidden comment: BC817-40,215)
VT3  Ic: 500mA  Vce: 45V  Package: SOT-23  [SOT-23_MED]  (hidden comment: BC817-40,215)
VT4  Ic: 500mA  Vce: 45V  Package: SOT-23  [SOT-23_MED]  (hidden comment: BC817-40,215)
VT5  Ic: 500mA  Vce: 45V  Package: SOT-23  [SOT-23_MED]  (hidden comment: BC817-40,215)
ZQ1  Frequency Tolerance: ±30ppm  Frequency: 12MHz  [CSM4-Series]  (hidden comment: CSM4Z-A2B3C3-40-12.0D18)

### Ports
DT0 (in), DT1 (in), EG_RX (in), EG_TX (out), EN_UART_EG (in), FB_L, FB_N, FRQSEL (in), I_FB (in), PWM_EN (out), SPWMOUT1 (out), SPWMOUT2 (out), SPWMOUT3 (out), SPWMOUT4 (out), SST (in), T_FB (in)

### Nets
5V: C7.1 C8.1 C29.2 C30.2 DD1.5(VCC) DD2.5(VCC) FB1.1 IC1.26(VCC) R9.2 R12.2 R15.2 R18.2 R25.2 R31.2
GND: C7.2 C8.2 C9.1 C10.2 C11.2 C15.2 C29.1 C30.1 IC1.3(GND_1) IC1.9(PWMTYP) IC1.12(GND_2) IC1.16(FRQADJ/VFB2) IC1.19(FRQSEL1) IC1.20(MODSEL) IC1.23(NC_2) IC1.32(VVVF) R11.1 R14.1 R17.1 R20.1 R22.1(CCW) R23.1 R24.2 R26.2 R33.1 R44.1 VT1.2(E) VT2.2(E) VT3.2(E) VT4.2(E) VT5.2(E)
cEN_UART_EG: R32.1 ; port EN_UART_EG
DT0: R10.1 ; port DT0
DT0: IC1.2(DT0) R9.1 VT1.3(C)  [a separate net that carries the same name]
DT1: R13.1 ; port DT1
DT1: IC1.1(DT1) R12.1 VT2.3(C)  [a separate net that carries the same name]
EG_RX: DD1.2(A) ; port EG_RX
EG_RX_UART: DD1.4(Y) IC1.4(RXD)
EG_TX: DD2.4(Y) ; port EG_TX
EG_TX_UART: DD2.2(A) IC1.5(TXD)
EN_PWM: IC1.6(SPWMEN) ; port PWM_EN
EN_UART: DD1.1(~{OE}) DD2.1(~{OE}) R31.1 VT5.3(C)
FQSEL: R19.1 ; port FRQSEL
FRQ_SEL: IC1.18(FRQSEL0) R18.1 VT4.3(C)
NEUTRAL: VD2.AN VD3.CA ; port FB_L
SST: R16.1 ; port SST
SST: IC1.21(SST) R15.1 VT3.3(C)  [a separate net that carries the same name]
TR_OUT_L: VD1.AN VD4.CA ; port FB_N
U_FB: C15.1 IC1.13(VFB) R22.2(WIPER)
NetC9_2: C9.2 IC1.10(OSC1) ZQ1.2(XTAL2)
NetC10_1: C10.1 IC1.11(OSC2) ZQ1.1(XTAL1)
NetC11_1: C11.1 FB1.2 IC1.17(VREF)
NetDD3_4: IC1.29(SPWMOUT3) ; port SPWMOUT3
NetDD3_7: IC1.30(SPWMOUT4) ; port SPWMOUT4
NetDD3_9: IC1.27(SPWMOUT1) ; port SPWMOUT1
NetDD3_12: IC1.28(SPWMOUT2) ; port SPWMOUT2
NetHG2_AN: HG2.AN(Anode) R44.2
NetHG2_CA: HG2.CA(Cathode) IC1.8(LEDOUT)
NetIC1_14: IC1.14(IFB) R24.1 ; port I_FB
NetIC1_15: IC1.15(TFB) R25.1 R26.1 ; port T_FB
NetR10_2: R10.2 R11.2 VT1.1(B)
NetR13_2: R13.2 R14.2 VT2.1(B)
NetR16_2: R16.2 R17.2 VT3.1(B)
NetR19_2: R19.2 R20.2 VT4.1(B)
NetR21_1: R21.1 R22.3(CW)
NetR21_2: R21.2 VD1.CA VD2.CA
NetR23_2: R23.2 VD3.AN VD4.AN
NetR32_2: R32.2 R33.2 VT5.1(B)

Not connected (* = marked no-connect by the designer): DD1 3(GND); DD2 3(GND); IC1 7(FANCTR)* 22(NC_1)* 24(LCDCLK)* 25(LCDDI)* 31(LCDEN)*

### Notes on the sheet
- Title
- Product:
- Project:
- Size:
- Date:
- Variant:
- A4
- Authors:
- Time:
- Sheet
- of
- Revision:
- @Vitech_ua
- Commit:
- (in symbol 293D106X9010A2TE3) +

### Library data of the parts
C7 = 293D106X9010A2TE3: 10uF 10V ±10% Case A Tantalum Capacitor RoHS, 3.4Ohm; Manufacturer: Vishay; Ajax_1C_ID: 58999; Ajax_1C_PN: 10uF 10V case A Vishay 293D106X9010A2TE3 Tantalum Capacitor SMD RoHS; Ajax_1С_Status: RND Only; Standard Lead Time: 20 Weeks; Component Status: Released; Dielectric Type: NONE; GUID_1C: 304cf5a9-8da3-11ed-a366-005056994834; Value: 10uF; Part Number: 293D106X9010A2TE3; Part Type: Tantalum; Component Type: SMD; Temperature Range: -55°C ~ 125°C; Tolerance: ±10%; ComponentLink1URL: https://eu.mouser.com/datasheet/2/427/293d-1763499.pdf; Supplier 1: Mouser; Supplier Part Number 1: 74-293D106X9010A2TE3; Replacement: NONE; Price: 0,1; ComponentLink1Description: Datasheet
C8 C11 C29 C30 = CL10B104KB8NNND: as C1 on sheet main; Value: 0.1uF; Part Number: CL10B104KB8NNND; Part Type: Ceramic / X7R / 0603; Component Type: SMD; Temperature Range: -55°C ~ 125°C; Tolerance: ±10%; ComponentLink1URL: https://media.digikey.com/pdf/Data%20Sheets/Samsung%20PDFs/CL_Series_MLCC_ds.pdf; Supplier 1: Digi-Key; Supplier Part Number 1: CL10B104KB8NNND-ND; Price: 0,0039378; ComponentLink1Description: Datasheet
C9 C10 = CL05C220JB5NNNC: 22pF 50V NP0, C0G ±5% 0402 Ceramic Capacitor RoHS; Manufacturer: Samsung Electro-Mechanics; Ajax_1C_ID: 26744; Ajax_1C_PN: 22pF 50V COG 5% 0402 Samsung CL05C220JB5NNNC Ceramic Capacitor SMD RoHS; Ajax_1С_Status: Substitution; Standard Lead Time: 22 Weeks; Component Status: Released; Replacement: NONE; GUID_1C: 5b73e2ce-71ce-11eb-ab70-0050569f2651; Value: 22pF; Part Number: CL05C220JB5NNNC; Part Type: Ceramic / C0G(NP0) / 0402; Component Type: SMD; Temperature Range: -55°C ~ 125°C; Tolerance: ±5%; ComponentLink1URL: https://media.digikey.com/pdf/Data%20Sheets/Samsung%20PDFs/CL_Series_MLCC_ds.pdf; Supplier 1: Digi-Key; Supplier Part Number 1: 1276-1116-2-ND; Price: 0,0034; ComponentLink1Description: Datasheet
C15 = GRM21BR61H475KE51L: 4.7uF 50V X5R ±10% 0805 Ceramic Capacitor RoHS; Manufacturer: Murata Electronics; Ajax_1C_ID: 10966; Ajax_1C_PN: 4.7uF 50V X5R 10% 0805 GRM21BR61H475KE51L/CL21A475KBQNNNE Ceramic Capacitor SMD RoHS; Ajax_1С_Status: Mass Production; Standard Lead Time: 15 Weeks; Component Status: Released; Replacement: NONE; GUID_1C: c30c0b00-b370-11e7-8189-14dda9d2d04d; Value: 4.7uF; Part Number: GRM21BR61H475KE51L; Part Type: Ceramic / X5R / 0805; Component Type: SMD; Temperature Range: -55°C ~ 85°C; Tolerance: ±10%; ComponentLink1URL: https://search.murata.co.jp/Ceramy/image/img/A01X/G101/ENG/GRM21BR61H475KE51-01.pdf; Supplier 1: Digi-Key; Supplier Part Number 1: 490-10751-2-ND; Price: 0,0396; ComponentLink1Description: Datasheet
DD1 DD2 = SN74LV1T125DBVR: Single Power Supply Single Buffer Gate with 3-State Output CMOS Logic Level Shifter, SOT-23-5; Manufacturer: Texas Instruments; Ajax_1C_ID: 37412; Ajax_1C_PN: SN74LV1T125DBVRG4 микросхема SOT-23-5 TI; Ajax_1С_Status: RND Only; Standard Lead Time: 35 Weeks; Component Status: On Review; Replacement: NONE; GUID_1C: 2979ae79-574b-11ec-a356-005056994834; Package: SOT-23-5; Part Number: SN74LV1T125DBVR; Part Type: Logic / Level Translator; Component Type: SMD; Temperature Range: -40°C ~ 125°C; ComponentLink1URL: https://www.ti.com/lit/ds/symlink/sn74lv1t125.pdf; Supplier 1: Digi-Key; Supplier Part Number 1: 296-37172-2-ND; Price: 0,386; ComponentLink1Description: Datasheet
FB1 = BLM15BD601SN1D: 600 Ohms @ 100MHz Power Line Ferrite Bead 0402, 200mA 650mOhm; Manufacturer: Murata Electronics; Ajax_1C_ID: 50383; Ajax_1C_PN: 600R BLM15BD601SN1D 0402 Murata Ferrite Bead; Ajax_1С_Status: RND Only; Saturation Current: NONE; Tolerance: ±25%; Component Status: Released; Standard Lead Time: 26 Weeks; GUID_1C: 598dd509-398f-11ed-a363-005056994834; Part Number: BLM15BD601SN1D; Part Type: Ferrite Bead; Component Type: SMD; Temperature Range: -55°C ~ 125°C; ComponentLink1URL: https://eu.mouser.com/datasheet/2/281/ENFA0018-1915754.pdf; Supplier 1: Mouser; Supplier Part Number 1: 81-BLM15BD601SN1D; Replacement: NONE; Price: 0,05; ComponentLink1Description: Datasheet
HG2 = LTST-C193TGKT-5A: Indication LED, Green 525nm, Clear, SMD 0603, Vf 2.5V - 3.1V, 28 ~ 280mcd @ 5 mA, 130°; Manufacturer: Lite-On Optoelectronics; Ajax_1C_ID: 10369; Ajax_1C_PN: LTST-C193TGKT-5A Green SMD LED 0603 12mcd 5mA 130deg RoHS pcs; Ajax_1С_Status: Mass Production; Component Status: Released; Replacement: NONE; GUID_1C: 4b87c4c2-6263-11e7-811b-14dda9d2d04d; Part Number: LTST-C193TGKT-5A; Part Type: LED / 0603; Component Type: SMD; Package: 0603; Wavelength: 525nm; Temperature Range: -20°C ~ 80°C; ComponentLink1URL: https://media.digikey.com/pdf/Data%20Sheets/Lite-On%20PDFs/LTST-C193TGKT-5A.pdf; Supplier 1: Digi-Key; Supplier Part Number 1: 160-1832-2-ND; Price: 0,10177143; ComponentLink1Description: Datasheet
IC1 = EG8010: Integrated Circuit; Manufacturer_Name: Glenair; Datasheet Link: https://datasheetspdf.com/pdf-file/729849/EGMicro/EG8010/1; Height: 1.6mm; Manufacturer_Part_Number: EG8010
R9 R11 R12 R14 R15 R17 R18 R20 R31 R33 = RC0603JR-0710KL: as R43 on sheet main; Value: 10k; Part Number: RC0603JR-0710KL; Component Type: SMD; Part Type: Thick Film; Temperature Range: -55°C ~ 155°C; ComponentLink1URL: https://eu.mouser.com/datasheet/2/447/PYu_RC_Group_51_RoHS_L_10-1664068.pdf; Supplier 1: Digi-Key; Supplier Part Number 1: 311-10KGRTR-ND; Price: 0,0006; ComponentLink1Description: Datasheet
R10 R13 R16 R19 R32 R44 = RC0603JR-071KL: 1 kOhms ±5%, 1/10W 0603 Thick Film Resistor; Manufacturer: Yageo; Ajax_1C_ID: 28124; Ajax_1C_PN: 1k 5% 0603 Resistors SMD RoHS; Ajax_1С_Status: Mass Production; Power Rating: 0.1W; Voltage: 75V; Component Status: Released; Temperature Stability: ±100ppm/°C; Replacement: NONE; GUID_1C: fbc5fd6b-8d66-11eb-ab70-0050569f2651; Value: 1k; Part Number: RC0603JR-071KL; Component Type: SMD; Part Type: Thick Film; Temperature Range: -55°C ~ 155°C; ComponentLink1URL: https://eu.mouser.com/datasheet/2/447/PYu_RC_Group_51_RoHS_L_11-1984063.pdf; Supplier 1: Digi-Key; Supplier Part Number 1: 311-1.0KGRTR-ND; Price: 0,00072; ComponentLink1Description: Datasheet
R21 R23 = RC1206FR-07100KL: 100 kOhms ±1%, 1/4W 1206 Thick Film Resistor; Manufacturer: Yageo; Ajax_1C_ID: 14373; Ajax_1C_PN: 100k 1% 1206 Resistors SMD RoHS; Ajax_1С_Status: Mass Production; Power Rating: 0.25W; Voltage: 200V; Component Status: Released; Temperature Stability: ±100ppm/°C; Replacement: NONE; GUID_1C: 93b23056-f3fc-11e8-ab4c-0050569f2651; Value: 100k; Part Number: RC1206FR-07100KL; Component Type: SMD; Part Type: Thick Film; Temperature Range: -55°C ~ 155°C; ComponentLink1URL: https://eu.mouser.com/datasheet/2/447/PYu_RC_Group_51_RoHS_L_10-1664068.pdf; Supplier 1: Digi-Key; Supplier Part Number 1: 311-100KFRTR-ND; Price: 0,00288; ComponentLink1Description: Datasheet
R22 = 3296W-1-103LF: 10 kOhms ±10% Trimmer Resistor, 0.5W, Through Hole 3/8", 4.83x9.53mm, 10.03mm Height; Manufacturer: Bourns; Ajax_1C_PN: NONE; Ajax_1С_Status: RND Only; Component Status: On Review; Temperature Stability: ±100ppm/°C; Value: 10k; Part Number: 3296W-1-103LF; Component Type: PTH; Part Type: Trimming Potentiometer; Power Rating: 0.5W; Temperature Range: -55°C ~ 125°C; ComponentLink1URL: https://www.bourns.com/data/global/pdfs/3296.pdf; Supplier 1: Mouser; Supplier Part Number 1: 652-3296W-1-103LF; Replacement: NONE; Price: NONE; ComponentLink1Description: Datasheet
R24-R26 = RC0603JR-070RL: 0 Ohms Jumper, 1/10W 0603 Thick Film Resistor; Manufacturer: Yageo; Tolerance: ±5%; Ajax_1C_ID: 2857; Ajax_1C_PN: 0R 5% 0603 Resistors SMD RoHS; Ajax_1С_Status: Mass Production; Power Rating: 0.1W; Voltage: 75V; Component Status: Released; Temperature Stability: NONE; GUID_1C: df4c284c-e567-11e2-9779-6c626deda1bb; Part Number: RC0603JR-070RL; Component Type: SMD; Part Type: Thick Film; Temperature Range: -55°C ~ 155°C; ComponentLink1URL: https://eu.mouser.com/datasheet/2/447/PYu_RC_Group_51_RoHS_L_10-1664068.pdf; Supplier 1: Digi-Key; Supplier Part Number 1: 311-0.0GRTR-ND; Replacement: NONE; Price: 0,0006; ComponentLink1Description: Datasheet
  R24 R25: Value: 0
  R26: Value: NC
VD1-VD4 = US1M: Diode Standard 1000V 1A, 75ns, SMA; Manufacturer: Diodec Semiconductor; Ajax_1C_ID: 20461; Ajax_1C_PN: US1M-DIO 1.0A 1000V 75ns, диод; Ajax_1С_Status: Mass Production; Component Status: Released; Vf: 1.7V @ 1A; Replacement: NONE; GUID_1C: 3d137b04-96a6-11ea-ab61-0050569f2651; Part Number: US1M; Part Type: General; Component Type: SMD; Marking: US1M; Current: 1A; Temperature Range: -50°C ~ 150°C; ComponentLink1URL: https://diotec.com/request/datasheet/us1a.pdf; Supplier 1: Arrow; Supplier Part Number 1: US1M; Price: 0,02875902; ComponentLink1Description: Datasheet
VT1-VT5 = BC817-40,215: 45V, 500mA NPN General Purpose Transistor; Manufacturer: Nexperia USA; Ajax_1C_ID: 6645; Ajax_1C_PN: BC817-40,215 : NPN, sot-23 транзистор; Ajax_1С_Status: Mass Production; Component Status: Released; Standard Lead Time: 4 Weeks; Replacement: NONE; GUID_1C: 5d499e81-0f64-11e5-ad28-a45d36c4a9e5; Part Number: BC817-40,215; Part Type: NPN; Component Type: SMD; Temperature Range: -65°C ~ 150°C; ComponentLink1URL: https://eu.mouser.com/datasheet/2/916/BC817_SER-1480622.pdf; Supplier 1: Mouser; Supplier Part Number 1: 771-BC817-40-T/R; Price: 0,094; ComponentLink1Description: Datasheet
ZQ1 = CSM4Z-A2B3C3-40-12.0D18: 12MHz, 18pF, ±30ppm, 40Ohm ESR, 1mW DL Crystal Quartz; Manufacturer: Cardinal Components Inc.; Ajax_1C_ID: 28125; Ajax_1C_PN: 12.000 MHz 30ppm 18pF CSM4Z-A2B3C3-40-12.0D18 кварцевый резонатор; Ajax_1С_Status: RND Only; Component Status: Released; Standard Lead Time: 8 Weeks; Replacement: NONE; GUID_1C: 0d925abc-8d67-11eb-ab70-0050569f2651; Part Number: CSM4Z-A2B3C3-40-12.0D18; Part Type: Crystal; Component Type: SMD; Load Capacitance: 18pF; Frequency Stability: ±30ppm; Temperature Range: -40°C ~ 85 °C; ComponentLink1URL: https://www.cardinalxtal.com/uploads/files/csm4-csm5.pdf; Supplier 1: Digi-Key; Supplier Part Number 1: 370-1146-2-ND; Price: 0,505; ComponentLink1Description: Datasheet